# EAGLE design schematic (EAGLE 8.6.0)
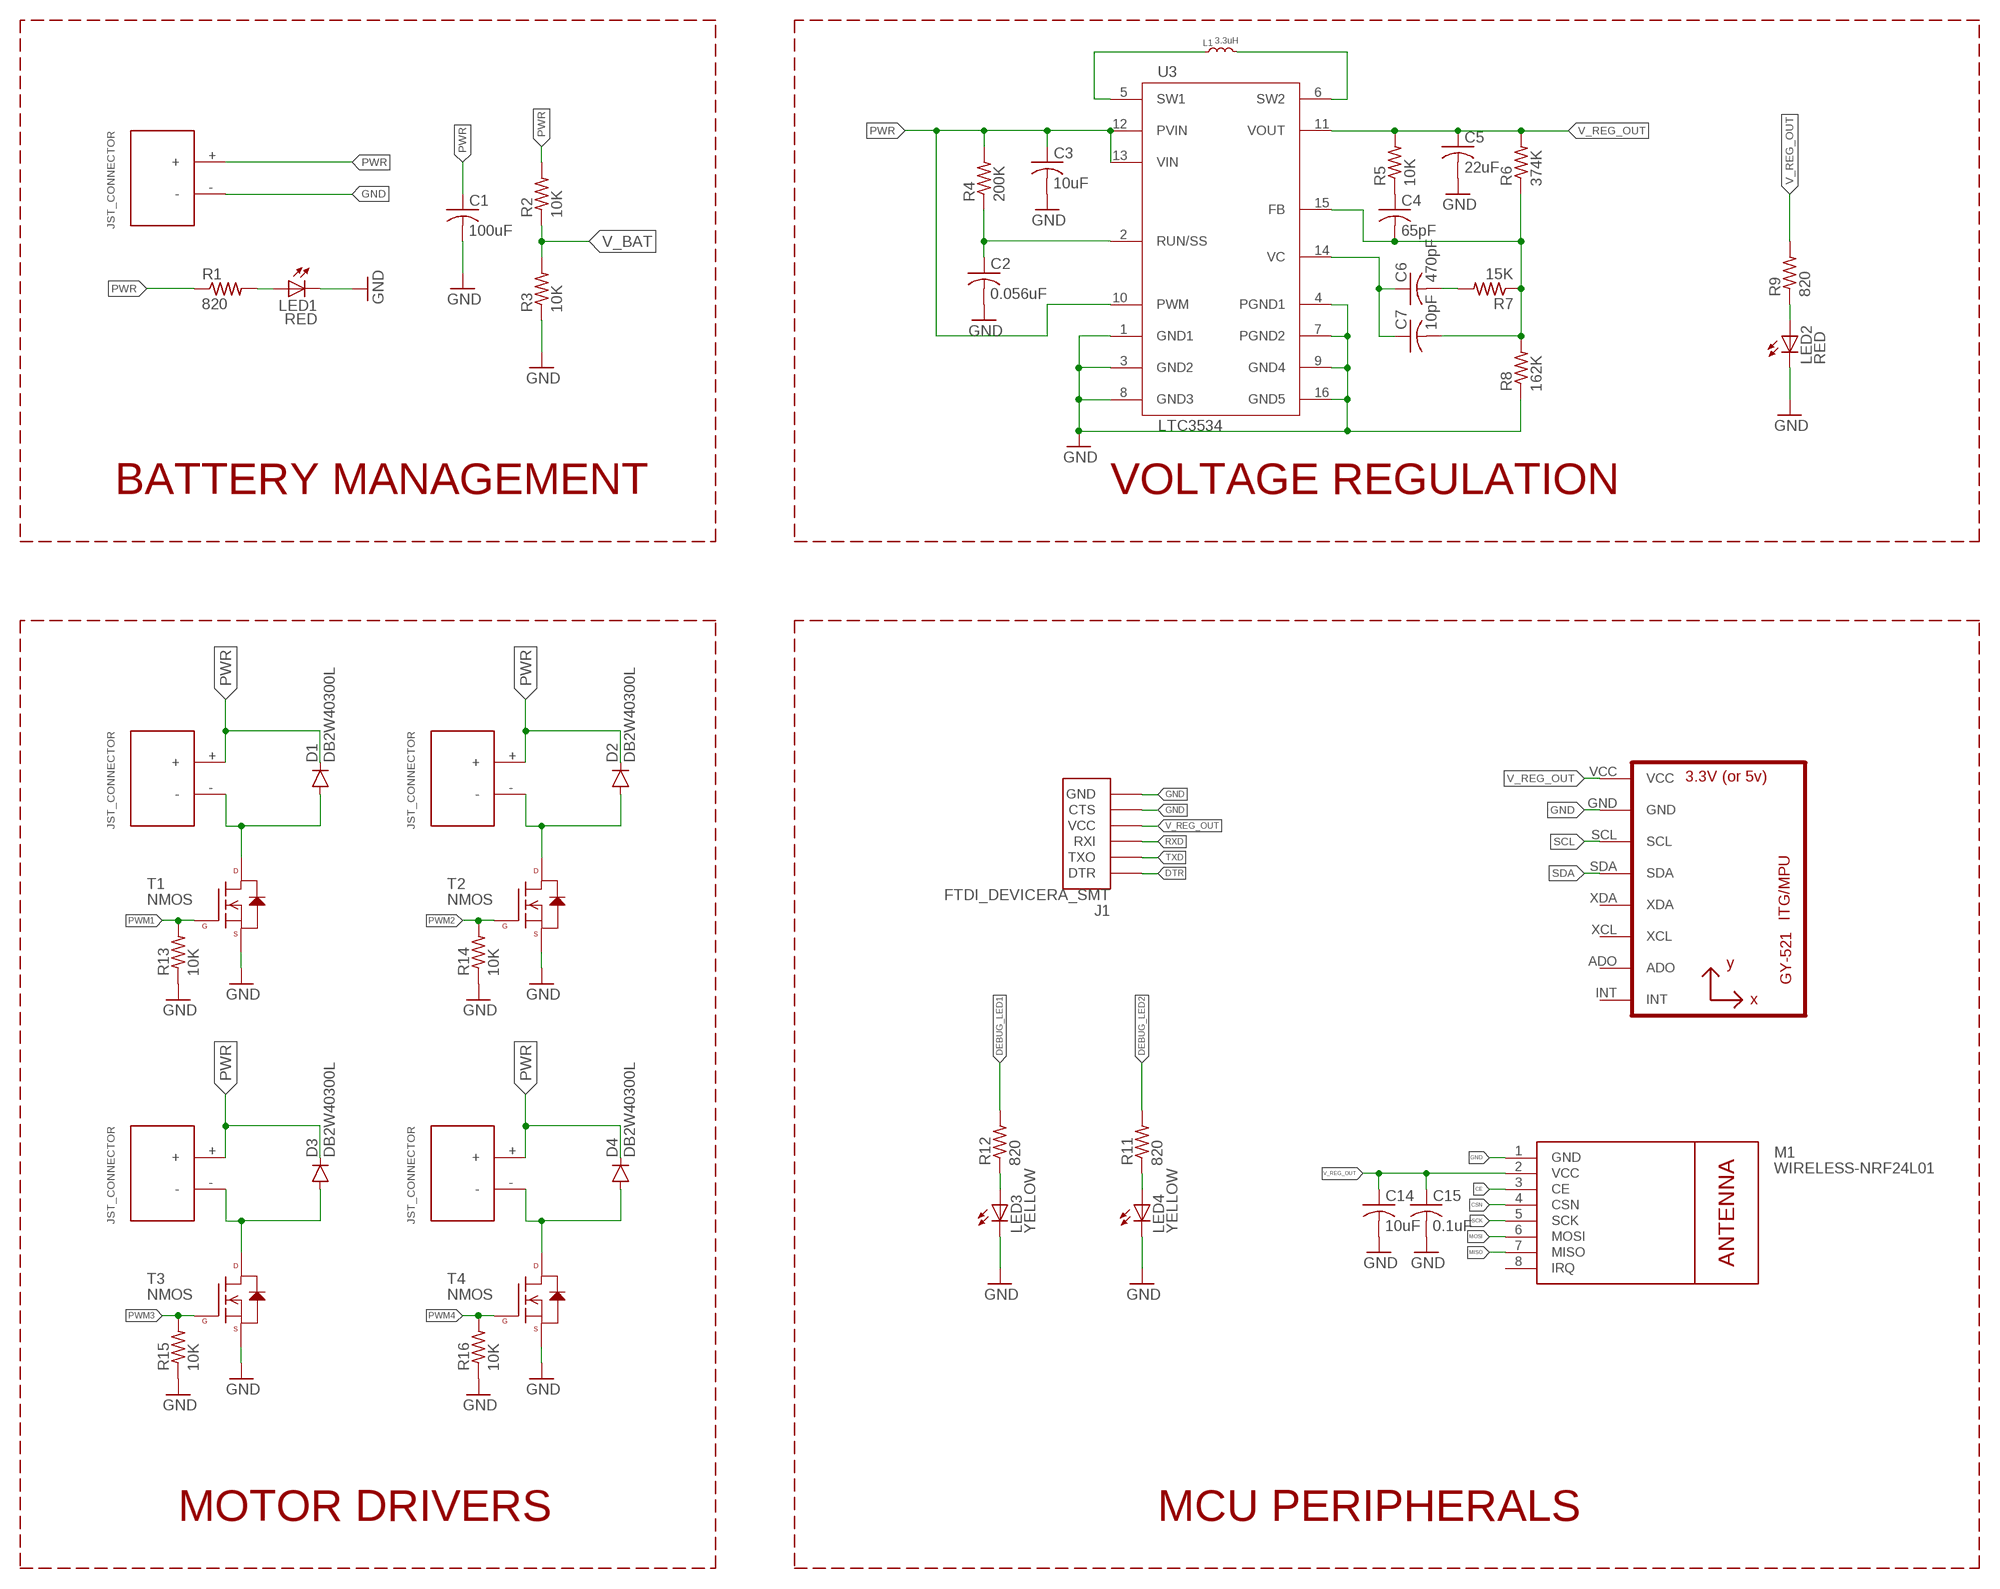
[diagram p0: schematic, sheet 1, part 1 of 2]
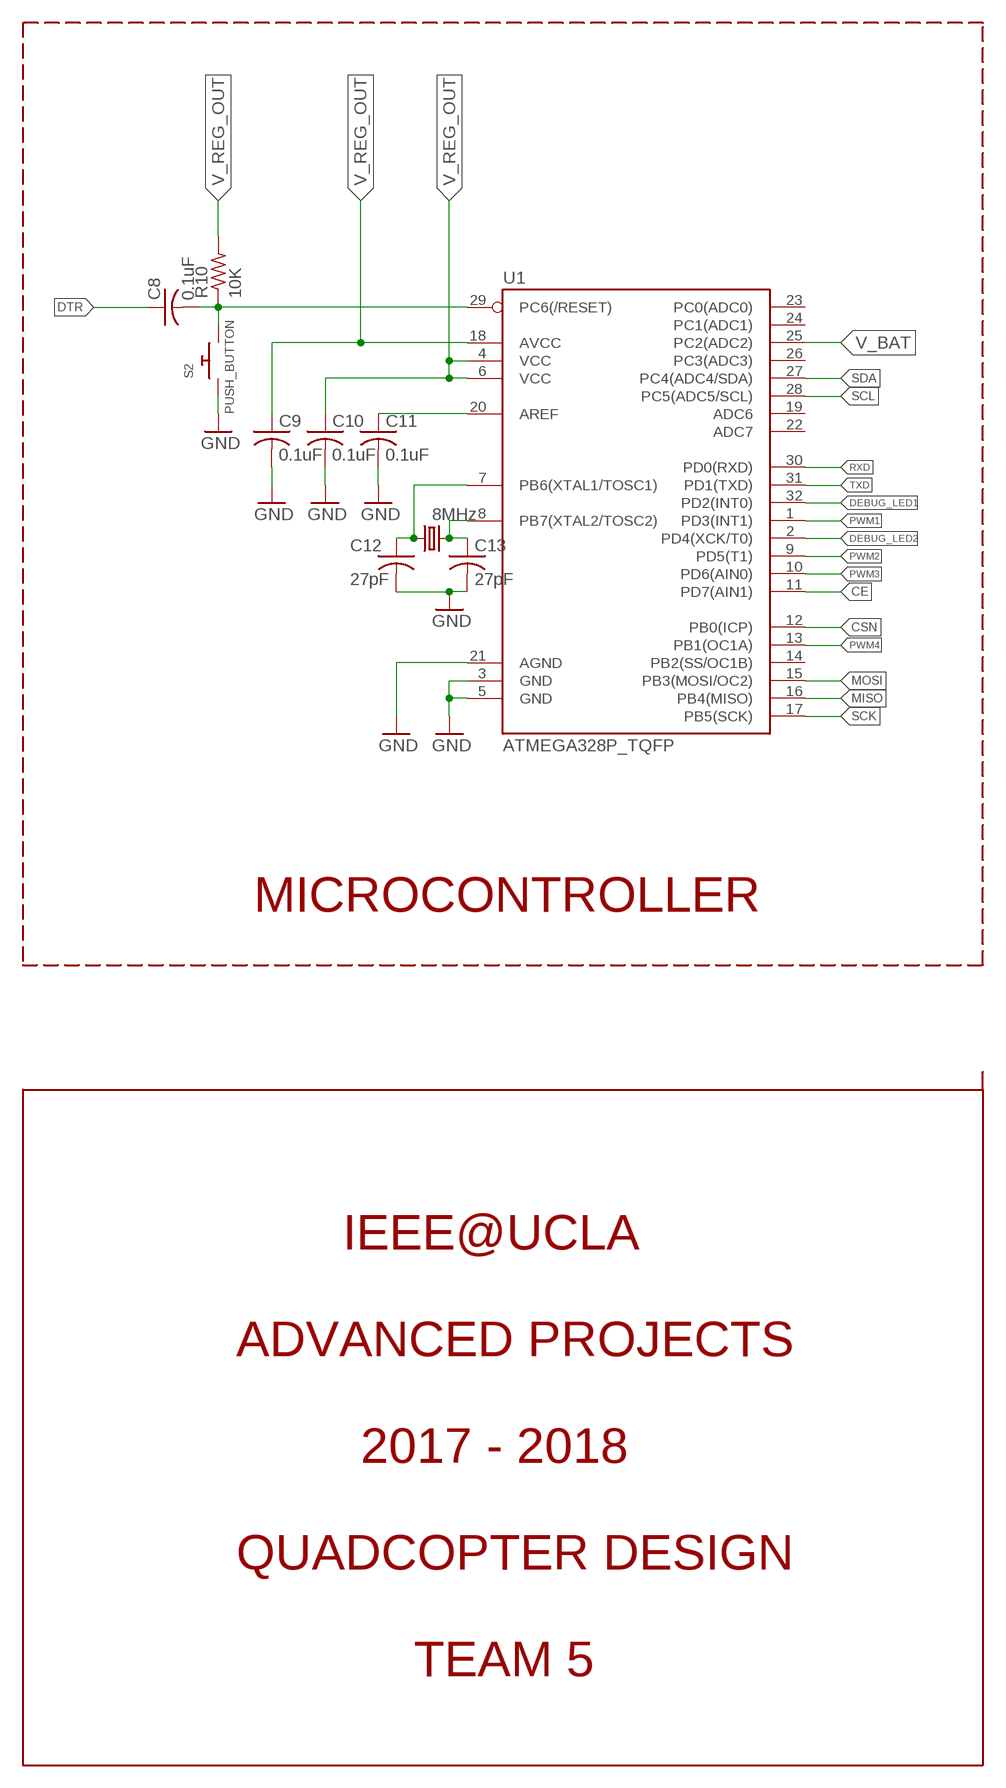
[diagram p1: schematic, sheet 1, part 2 of 2]

## Parts
C1  100uF  C-USC1210  [C1210]
C2  0.056uF  C-USC0603  [C0603]
C3  10uF  C-USC0603  [C0603]
C4  65pF  C-USC1206  [C1206]
C5  22uF  C-USC0603  [C0603]
C6  470pF  C-USC0603  [C0603]
C7  10pF  C-USC0603  [C0603]
C8  0.1uF  C-USC0603  [C0603]
C9  0.1uF  C-USC0603  [C0603]
C10  0.1uF  C-USC0603  [C0603]
C11  0.1uF  C-USC0603  [C0603]
C12  27pF  C-USC0603  [C0603]
C13  27pF  C-USC0603  [C0603]
C14  10uF  C-USC0603  [C0603]
C15  0.1uF  C-USC0603  [C0603]
D1  DB2W40300L  [MINI2-F3-B]
D2  DB2W40300L  [MINI2-F3-B]
D3  DB2W40300L  [MINI2-F3-B]
D4  DB2W40300L  [MINI2-F3-B]
J1  FTDI_DEVICERA_SMT  [FTDI_DEVICE_RA_SMT]
L1  3.3uH  INDUCTOR.XAL4020  [XAL4020]
LED1  RED  LEDSML0603  [SML0603]
LED2  RED  LEDSML0603  [SML0603]
LED3  YELLOW  LEDSML0603  [SML0603]
LED4  YELLOW  LEDSML0603  [SML0603]
M1  WIRELESS-NRF24L01  [WIRELESS-NRF24L01]
Q1  8MHz  CSM-7X-DU  [CSM-7X-DU]
R1  820  R-US_R0603  [R0603]
R2  10K  R-US_R0603  [R0603]
R3  10K  R-US_R0603  [R0603]
R4  200K  R-US_R0603  [R0603]
R5  10K  R-US_R0603  [R0603]
R6  374K  R-US_R0603  [R0603]
R7  15K  R-US_R0603  [R0603]
R8  162K  R-US_R0603  [R0603]
R9  820  R-US_R0603  [R0603]
R10  10K  R-US_R0603  [R0603]
R11  820  R-US_R0603  [R0603]
R12  820  R-US_R0603  [R0603]
R13  10K  R-US_R0603  [R0603]
R14  10K  R-US_R0603  [R0603]
R15  10K  R-US_R0603  [R0603]
R16  10K  R-US_R0603  [R0603]
S2  PUSH_BUTTON  SWITCH_PUSHBUTTONSOFTTOUCHSMD_SJ  [PUSHBUTTON_SMD_SJ]
T1  NMOS  N-CHANNEL-MOSFET-IRLML6244TRPBF  [SOT23-3]
T2  NMOS  N-CHANNEL-MOSFET-IRLML6244TRPBF  [SOT23-3]
T3  NMOS  N-CHANNEL-MOSFET-IRLML6244TRPBF  [SOT23-3]
T4  NMOS  N-CHANNEL-MOSFET-IRLML6244TRPBF  [SOT23-3]
U1  ATMEGA328P_TQFP  [TQFP32-08]
U2  GY-521MPU6050  [GY-521]
U3  LTC3534  [SSOP-16GN]
U$1  JST_CONNECTOR_FEMALE  [JST_CONNECTOR_FEMALE]
U$4  JST_CONNECTOR_FEMALE  [JST_CONNECTOR_FEMALE]
U$7  JST_CONNECTOR_FEMALE  [JST_CONNECTOR_FEMALE]
U$10  JST_CONNECTOR_FEMALE  [JST_CONNECTOR_FEMALE]
U$13  JST_CONNECTOR_FEMALE  [JST_CONNECTOR_FEMALE]

## Nets
CE: M1.3(CE) U1.11(PD7(AIN1))
CSN: M1.4(CSN) U1.12(PB0(ICP))
DEBUG_LED1: R12.2 U1.32(PD2(INT0))
DEBUG_LED2: R11.2 U1.2(PD4(XCK/T0))
DTR: C8.1 J1.1(DTR)
GND: C1.2 C2.2 C3.2 C5.2 C9.2 C10.2 C11.2 C12.2 C13.2 C14.2 C15.2 J1.5(CTS) J1.6(GND) LED1.C LED2.C LED3.C LED4.C M1.1(GND) R3.1 R8.1 R13.1 R14.1 R15.1 R16.1 S2.P$1 T1.2(S) T2.2(S) T3.2(S) T4.2(S) U1.3(GND) U1.5(GND) U1.21(AGND) U2.GND U3.1(GND1) U3.3(GND2) U3.4(PGND1) U3.7(PGND2) U3.8(GND3) U3.9(GND4) U3.16(GND5) U$1.-
MISO: M1.7(MISO) U1.16(PB4(MISO))
MOSI: M1.6(MOSI) U1.15(PB3(MOSI/OC2))
N$1: C12.1 Q1.1 U1.7(PB6(XTAL1/TOSC1))
N$2: C8.2 R10.1 S2.P$2 U1.29(PC6(/RESET))
N$3: D1.POS(PPIN) T1.3(D) U$4.-
N$4: C13.1 Q1.2 U1.8(PB7(XTAL2/TOSC2))
N$5: D2.POS(PPIN) T2.3(D) U$7.-
N$6: D3.POS(PPIN) T3.3(D) U$10.-
N$7: D4.POS(PPIN) T4.3(D) U$13.-
N$8: L1.1 U3.5(SW1)
N$9: L1.2 U3.6(SW2)
N$10: LED1.A R1.2
N$11: LED2.A R9.1
N$12: LED3.A R12.1
N$13: LED4.A R11.1
N$14: C4.1 R5.1
N$16: C2.1 R4.1 U3.2(RUN/SS)
N$18: C4.2 C7.2 R6.1 R7.1 R8.2 U3.15(FB)
N$19: C6.1 C7.1 U3.14(VC)
N$20: C6.2 R7.2
N$25: C11.1 U1.20(AREF)
PWM1: R13.2 T1.1(G) U1.1(PD3(INT1))
PWM2: R14.2 T2.1(G) U1.9(PD5(T1))
PWM3: R15.2 T3.1(G) U1.10(PD6(AIN0))
PWM4: R16.2 T4.1(G) U1.13(PB1(OC1A))
PWR: C1.1 C3.1 D1.NEG(GPIN) D2.NEG(GPIN) D3.NEG(GPIN) D4.NEG(GPIN) R1.1 R2.2 R4.2 U3.10(PWM) U3.12(PVIN) U3.13(VIN) U$1.+ U$4.+ U$7.+ U$10.+ U$13.+
RXD: J1.3(RXI) U1.30(PD0(RXD))
SCK: M1.5(SCK) U1.17(PB5(SCK))
SCL: U1.28(PC5(ADC5/SCL)) U2.SCL
SDA: U1.27(PC4(ADC4/SDA)) U2.SDA
TXD: J1.2(TXO) U1.31(PD1(TXD))
V_BAT: R2.1 R3.2 U1.25(PC2(ADC2))
V_REG_OUT: C5.1 C9.1 C10.1 C14.1 C15.1 J1.4(VCC) M1.2(VCC) R5.2 R6.2 R9.2 R10.2 U1.4(VCC) U1.6(VCC) U1.18(AVCC) U2.VCC U3.11(VOUT)
Unconnected: M1.8(IRQ) U1.14(PB2(SS/OC1B)) U1.19(ADC6) U1.22(ADC7) U1.23(PC0(ADC0)) U1.24(PC1(ADC1)) U1.26(PC3(ADC3)) U2.ADO U2.INT U2.XCL U2.XDA

## Notes on the sheet
- BATTERY MANAGEMENT | VOLTAGE REGULATION
- MICROCONTROLLER
- IEEE@UCLA
- ADVANCED PROJECTS
- 2017 - 2018
- QUADCOPTER DESIGN
- TEAM 5
- MOTOR DRIVERS | MCU PERIPHERALS

## Library data of the parts
C1 C4 C8-C11 = rcl:C-US: CAPACITOR, American symbol; SPICEPREFIX: C
C2 C3 C5-C7 C12-C15 = resistor:C-US: CAPACITOR, American symbol
D1-D4 = quad:DB2W40300L
J1 = quad:FTDI_DEVICE: Connector which mates to FTDI basic or FTDI cable.; PROD_ID: CONN-08971
L1 = coilcraft:INDUCTOR
LED1-LED4 = led:LED: LED OSRAM: - CHIPLED LG R971, LG N971, LY N971, LG Q971, LY Q971, LO R971, LY R971 LH N974, LH R974 LS Q976, LO Q976, LY Q976 LO Q996 - Hyper CHIPLED LW Q18S LB Q993, LB Q99A, LB R99A - SideLED LS A670, LO A670, LY A670, LG A670, LP A670 LB A673, LV A673, LT A673, LW A673 LH A674 LY A675 LS A676, LA A676, LO A676, LY A676, LW A676 LS A679, LY A679, LG A679 - Hyper Micro SIDELED® LS Y876, LA Y876, LO Y876, LY Y876 LT Y87S - SmartLED LW L88C, LW L88S LB L89C, LB L89S, LG L890 LS L89K, LO L89K, LY L89K LS L896, LA L896, LO L896, LY L896 - TOPLED LS T670, LO T670, LY T670, LG T670, LP T670 LSG T670, LSP T670, LSY T670, LOP T670, LYG T670 LG T671, LOG T671, LSG T671 LB T673, LV T673, LT T673, LW T673 LH T674 LS T676, LA T676, LO T676, LY T676, LB T676, LH T676, LSB T676, LW T676 LB T67C, LV T67C, LT T67C, LS T67K, LO T67K, LY T67K, LW E67C LS E67B, LA E67B, LO E67B, LY E67B, LB E67C, LV E67C, LT E67C LW T67C LS T679, LY T679, LG T679 LS T770, LO T770, LY T770, LG T770, LP T770 LB T773, LV T773, LT T773, LW T773 LH T774 LS E675, LA E675, LY E675, LS T675 LS T776, LA T776, LO T776, LY T776, LB T776 LHGB T686 LT T68C, LB T68C - Hyper Mini TOPLED® LB M676 - Mini TOPLED Santana® LG M470 LS M47K, LO M47K, LY M47K Source: http://www.osram.convergy.de LUXEON: - LUMILED® LXK2-PW12-R00, LXK2-PW12-S00, LXK2-PW14-U00, LXK2-PW14-V00 LXK2-PM12-R00, LXK2-PM12-S00, LXK2-PM14-U00 LXK2-PE12-Q00, LXK2-PE12-R00, LXK2-PE12-S00, LXK2-PE14-T00, LXK2-PE14-U00 LXK2-PB12-K00, LXK2-PB12-L00, LXK2-PB12-M00, LXK2-PB14-N00, LXK2-PB14-P00, LXK2-PB14-Q00 LXK2-PR12-L00, LXK2-PR12-M00, LXK2-PR14-Q00, LXK2-PR14-R00 LXK2-PD12-Q00, LXK2-PD12-R00, LXK2-PD12-S00 LXK2-PH12-R00, LXK2-PH12-S00 LXK2-PL12-P00, LXK2-PL12-Q00, LXK2-PL12-R00 Source: www.luxeon.com KINGBRIGHT: KA-3528ASYC Source: www.kingbright.com
M1 = quad:WIRELESS-NRF24L01: 2.4 GHz Wireless Module based on NRF24L01 chip
Q1 = crystal:CSM-7X-DU: SMD CRYSTAL Source: www.ecsxtal.com .. Crystal 3.6864MHz CSM_7X_DU.PDF; OC_FARNELL: unknown; OC_NEWARK: unknown
R1 R9 R11 R12 = rcl:R-US_: RESISTOR, American symbol; SPICEPREFIX: R
R2-R8 R10 R13-R16 = resistor:R-US_: RESISTOR, American symbol
S2 = adafruit:SWITCH_PUSHBUTTON: Buttons SOFTTOUCHSMD_SJ - Soft touch temporary push button (Super Junk Akihabara) Compatible with SKPMANE010 [Mouser: 688-SKPMAN] C&K_KSS = Digikey: KSS221GLFS
T1-T4 = quad:N-CHANNEL-MOSFET: N-Channel MOSFET Mode Field Effect Transistor; DATASHEET: http://www.mouser.com/ds/2/196/irlml6244pbf-936666.pdf; MOUSER: 942-IRLML6244TRPBF; URL: http://www.mouser.com/Search/ProductDetail.aspx?R=IRLML6244TRPBFvirtualkey57370000virtualkey942-IRLML6244TRPBF
U1 = quad:ATMEGA328P_TQFP; PROD_ID: IC-09069
U2 = quad:GY-521
U3 = LTC3534:LTC3534
U$1 U$4 U$7 U$10 U$13 = quad:JST_CONNECTOR_FEMALE

## Board
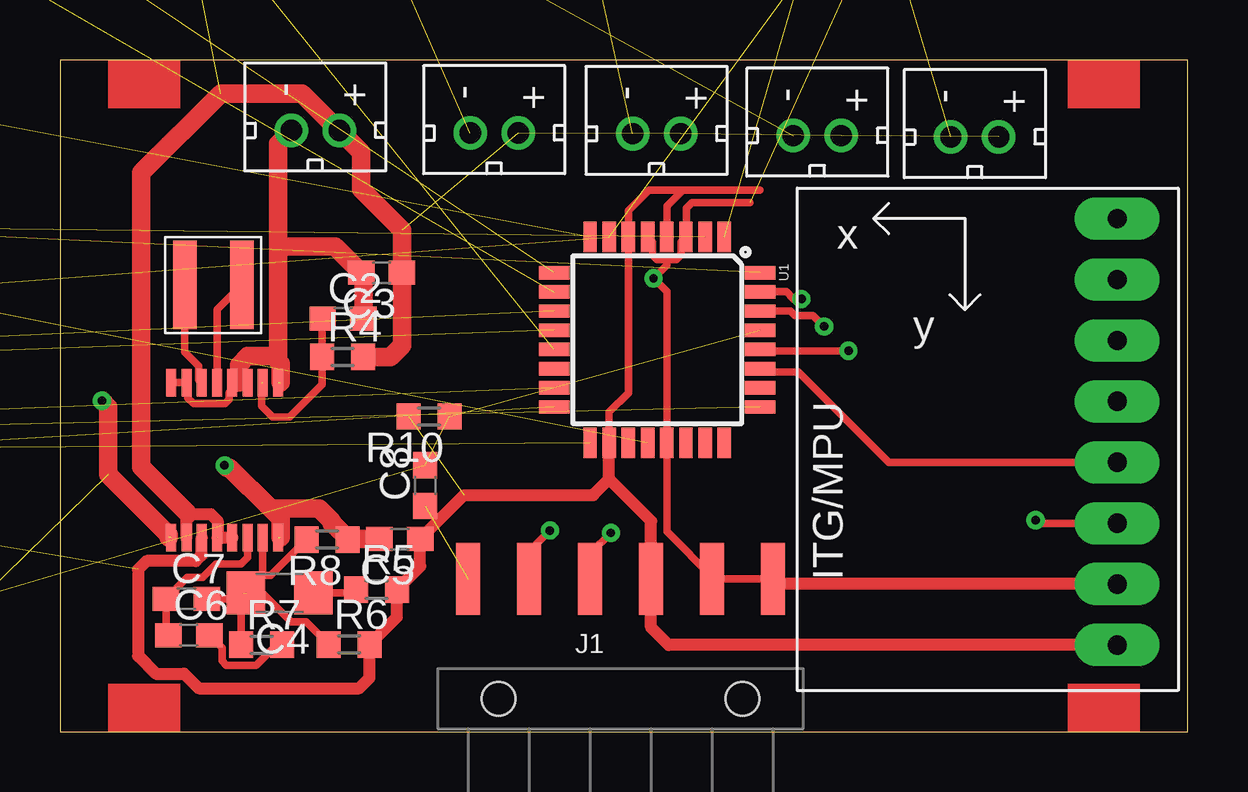
[diagram p2: board, top side]
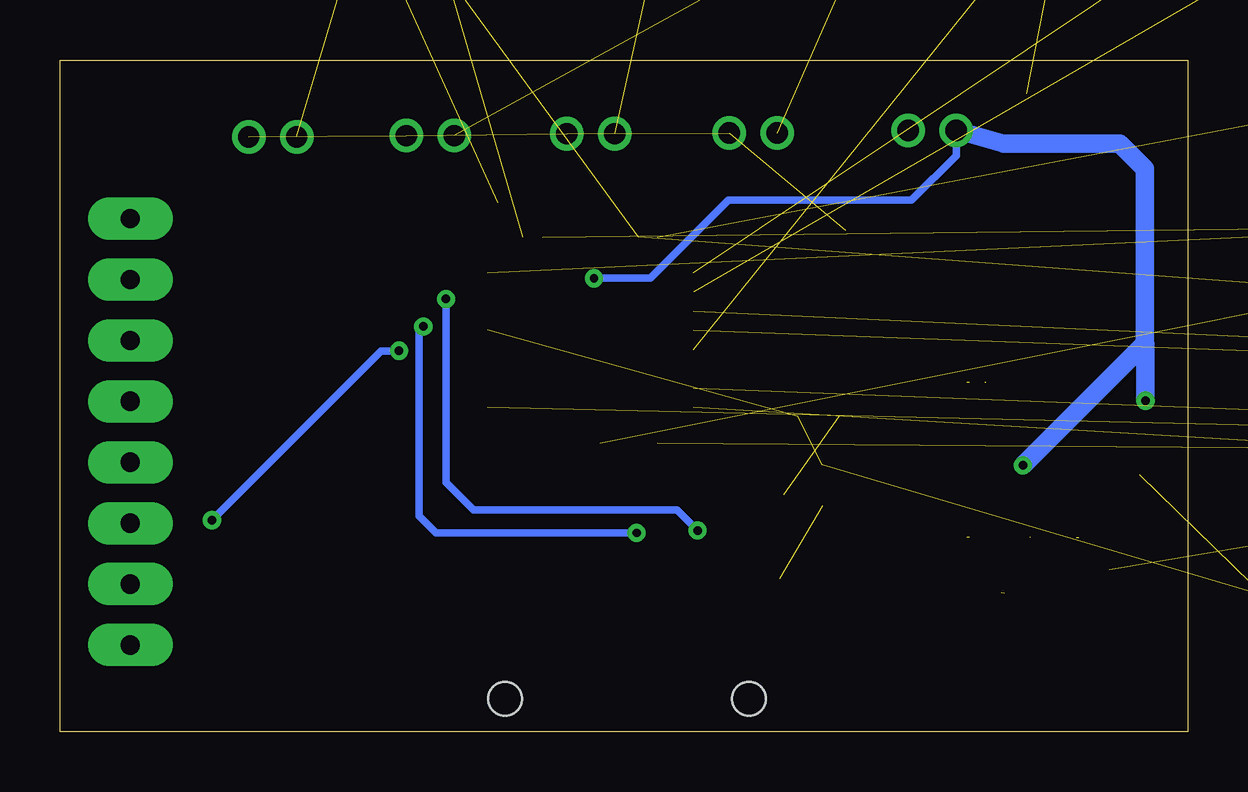
[diagram p3: board, bottom side, seen from below]

Size 47 x 28 mm. Coordinates in mm from the lower left corner, seen from the top.
Outline: 0,0 47,0 47,28 0,28 0,0
Copper layers (1*16): Top 0.035mm / dielectric 1.5mm / Bottom 0.035mm
Design rules "default": minimum track width 6mil, minimum drill 0.35mm, track to track 6mil, track to pad 6mil, pad to pad 6mil, via to via 6mil, smd to smd 6mil, copper to edge 40mil, drill to drill 6mil, minimum pad ring 10mil, minimum via ring 8mil, stop-mask expansion 4mil, vias tented up to drill 0mil, thermal gap 10mil

### Footprints (pad centres in the part's own frame; a part is rotated, then mirrored left to right if it is on the bottom)
C1210 = smd 1.6 x 2.7: 1 -1.4,0; 2 1.4,0
C0603 = smd 1.1 x 1: 1 -0.85,0; 2 0.85,0
C1206 = smd 1.6 x 1.8: 1 -1.4,0; 2 1.4,0
MINI2-F3-B = smd 1.22 x 0.85: NEG 0,1.55; POS 0,-1.5
FTDI_DEVICE_RA_SMT = smd 1 x 3: 1 -6.35,5; 2 -3.81,5; 3 -1.27,5; 4 1.27,5; 5 3.81,5; 6 6.35,5 | hole 1.4: -5.08,0; 5.08,0
XAL4020 = smd 0.98 x 3.7: 1 -1.185,0; 2 1.185,0
SML0603 = smd 0.8 x 0.8: A 0.75,0; C -0.75,0
WIRELESS-NRF24L01 = drill 1 square: 1 -12.7,6.35 | drill 1: 2 -10.16,6.35; 3 -12.7,3.81; 4 -10.16,3.81; 5 -12.7,1.27; 6 -10.16,1.27; 7 -12.7,-1.27; 8 -10.16,-1.27
CSM-7X-DU = smd 5.5 x 2: 1 -4.75,0; 2 4.75,0
R0603 = smd 1 x 1.1: 1 -0.85,0; 2 0.85,0
PUSHBUTTON_SMD_SJ = smd 2 x 2: P$1 3,0; P$2 -3,0
SOT23-3 = smd 0.8 x 0.9: 1 -0.95,-1; 2 0.95,-1; 3 0,1.1
TQFP32-08 = smd 1.27 x 0.559: 1 -4.293,2.8; 2 -4.293,2; 3 -4.293,1.2; 4 -4.293,0.4; 5 -4.293,-0.4; 6 -4.293,-1.2; 7 -4.293,-2; 8 -4.293,-2.8; 17 4.293,-2.8; 18 4.293,-2; 19 4.293,-1.2; 20 4.293,-0.4; 21 4.293,0.4; 22 4.293,1.2; 23 4.293,2; 24 4.293,2.8 | smd 0.559 x 1.27: 9 -2.8,-4.293; 10 -2,-4.293; 11 -1.2,-4.293; 12 -0.4,-4.293; 13 0.4,-4.293; 14 1.2,-4.293; 15 2,-4.293; 16 2.8,-4.293; 25 2.8,4.293; 26 2,4.293; 27 1.2,4.293; 28 0.4,4.293; 29 -0.4,4.293; 30 -1.2,4.293; 31 -2,4.293; 32 -2.8,4.293
GY-521 = drill 0.8 pad 1.778 long: ADO -8.89,-6.35; GND -8.89,6.35; INT -8.89,-8.89; SCL -8.89,3.81; SDA -8.89,1.27; VCC -8.89,8.89; XCL -8.89,-3.81; XDA -8.89,-1.27
SSOP-16GN = smd 0.419 x 1.143: 1 -2.223,-3.226; 2 -1.587,-3.226; 3 -0.953,-3.226; 4 -0.318,-3.226; 5 0.318,-3.226; 6 0.953,-3.226; 7 1.587,-3.226; 8 2.223,-3.226; 9 2.223,3.226; 10 1.587,3.226; 11 0.953,3.226; 12 0.318,3.226; 13 -0.318,3.226; 14 -0.953,3.226; 15 -1.587,3.226; 16 -2.223,3.226
JST_CONNECTOR_FEMALE = drill 0.889: + 0,1; - 0,-1

### Placement (x,y rotation side)
C1  -182.26,97.2 0 top  (outside the outline)
C2  11.8,17.22 0 top
C3  13.41,19.13 180 top
C4  9.16,5.78 180 top
C5  14.17,8.03 180 top
C6  5.37,4.02 0 top
C7  5.27,5.54 0 top
C8  15.23,10.25 90 top
C9  -182.07,63.31 0 top  (outside the outline)
C10  -182.07,58.43 0 top  (outside the outline)
C11  -182.07,53.56 0 top  (outside the outline)
C12  33.05,33.38 0 top  (outside the outline)
C13  -31.75,72.39 0 top  (outside the outline)
C14  -254.72,-18 0 top  (outside the outline)
C15  -254.72,-22.87 0 top  (outside the outline)
D1  -67.31,62.23 0 top  (outside the outline)
D2  -69.85,62.23 0 top  (outside the outline)
D3  10.44,86.79 0 top  (outside the outline)
D4  -2.16,70.38 0 top  (outside the outline)
J1  23.37,1.37 0 top
L1  6.39,18.62 180 top
LED1  -255.32,-47.86 0 top  (outside the outline)
LED2  -255.32,-51.7 0 top  (outside the outline)
LED3  -255.32,-55.55 0 top  (outside the outline)
LED4  -255.32,-59.39 0 top  (outside the outline)
M1  -44.45,10.16 0 top  (outside the outline)
Q1  -13.54,22.64 90 top  (outside the outline)
R1  -133.35,35.33 0 top  (outside the outline)
R2  -255.9,11.78 0 top  (outside the outline)
R3  -255.9,6.91 0 top  (outside the outline)
R4  11.78,15.62 0 top
R5  13.2,5.92 0 top
R6  12.05,3.63 0 top
R7  8.41,3.62 0 top
R8  11.14,8 180 top
R9  -133.35,31.03 0 top  (outside the outline)
R10  15.38,13.13 180 top
R11  -133.35,22.44 0 top  (outside the outline)
R12  -133.35,26.74 0 top  (outside the outline)
R13  -175.35,117.32 0 top  (outside the outline)
R14  -175.35,112.44 0 top  (outside the outline)
R15  -255.9,-27.75 0 top  (outside the outline)
R16  -255.9,-32.63 0 top  (outside the outline)
S2  -8.8,3.11 0 top  (outside the outline)
T1  33.15,37.08 0 top  (outside the outline)
T2  -50.8,68.58 0 top  (outside the outline)
T3  -63.5,68.58 0 top  (outside the outline)
T4  -24.13,73.66 0 top  (outside the outline)
U1  24.89,16.33 270 top
U2  35.18,12.5 180 top
U3  6.86,11.32 180 top
U$1  10.64,25.07 270 top
U$4  38.13,24.79 270 top
U$7  31.57,24.85 270 top
U$10  24.87,24.93 270 top
U$13  18.1,24.96 270 top

### Tracks (layer width: path | path; a pad name or v marks a point on that pad's centre or on a via)
CE  (1 unrouted)
CSN  (1 unrouted)
DEBUG_LED1  (1 unrouted)
DEBUG_LED2  (1 unrouted)
DTR  (1 unrouted)
GND  (via drill 0.35)  (26 unrouted)
  Top 0.305: U3.4 7.47,14.54 | 7.47,14.54 U3.3 | 7.47,14.54 7.06,14.13 7.06,13.85 6.88,13.67 5.57,13.67 5.33,13.91 5.33,14.49 U3.7 U3.8 | 25.3,19.68 24.89,19.68 24.71,19.86 24.71,20.41 U1.5 | 25.3,19.68 25.7,19.68 25.88,19.86 25.88,20.41 U1.3 26.11,20.64 26.11,21.82 26.34,22.05 28.75,22.05 | 25.3,19.68 25.3,19.46 v24.74,18.9 25.29,18.34 U1.21 25.29,8.33 27.25,6.37 | J1.6 29.39,6.37 27.25,6.37 | 27.25,6.37 J1.5
  Top 0.508: U2.GND 29.61,6.15 29.39,6.37
  Top 0.762: C2.2 12.65,19.03 C3.2 11.46,20.22 9.09,20.22 | 7.47,14.54 7.47,15.29 7.83,15.65 8.89,15.65 9.09,15.45 | 9.09,15.45 9.09,20.22 | 9.09,15.45 9.09,15.44 9.19,15.34 9.19,14.54 | 4.53,8.09 4.53,8.2 2.01,10.72 2.01,13.54 v1.75,13.79 | v6.86,11.1 6.96,11 7.08,11 8.79,9.29 | 9.09,20.22 9.09,24.51 U$1.- | C5.2 12.01,8.03 | 12.01,8.03 R8.1 | 8.79,9.29 9.19,8.88 9.19,8.09 | 11.32,8.67 11.32,8.72 | 8.79,9.29 10.8,9.29 11.32,8.77 11.32,8.72 | 11.32,8.72 12.01,8.03
  Bottom 0.305: v24.74,18.9 22.38,18.9 19.13,22.15 11.51,22.15 9.64,24.01 U$1.-
  Bottom 0.762: v6.86,11.1 1.78,16.18 | 1.78,16.18 1.78,23.47 2.82,24.51 7.66,24.51 U$1.- | v1.75,13.79 1.75,16.15 1.78,16.18
MISO  (1 unrouted)
MOSI  (1 unrouted)
N$1  (2 unrouted)
N$2  (3 unrouted)
N$3  (2 unrouted)
N$4  (2 unrouted)
N$5  (2 unrouted)
N$6  (2 unrouted)
N$7  (2 unrouted)
N$8
  Top 0.305: U3.5 6.54,17.59 L1.1
N$9
  Top 0.305: U3.6 5.79,14.66 5.79,15.24 5.2,15.83 L1.2
N$10  (1 unrouted)
N$11  (1 unrouted)
N$12  (1 unrouted)
N$13  (1 unrouted)
N$14
  Top 0.305: C4.1 12.21,5.78 R5.1
N$16  (1 unrouted)
  Top 0.305: C2.1 10.93,17.2 R4.1 10.93,14.46 9.58,13.11 8.87,13.11 8.4,13.57 8.4,14.54
N$18  (1 unrouted)
  Top 0.305: 7.22,5.72 C4.2 | C4.2 8.45,6.47 8.45,6.5 | 7.38,3.81 R7.1 7.56,5.4 7.42,5.54 | C7.2 7.42,5.54 | 7.42,5.54 7.64,5.76 | U3.15 8.45,6.5 | R6.1 10.26,4.57 9.63,4.57 8.43,5.78 C4.2 | R8.2 8.79,6.5 8.45,6.5
N$19
  Top 0.305: C6.1 4.42,4.12 C7.1 5.31,6.43 5.94,6.43 6.5,6.98 7.54,6.98 7.82,7.25 U3.14
N$20
  Top 0.305: R7.2 9.04,3.62 8.19,2.76 6.93,2.76 6.75,2.94 6.75,3.48 C6.2
N$25  (1 unrouted)
PWM1  (2 unrouted)
PWM2  (2 unrouted)
PWM3  (2 unrouted)
PWM4  (2 unrouted)
PWR  (12 unrouted)
  Top 0.508: U3.13 6.57,8.09 6.57,8.79 6.29,9.07 5.34,9.07 5.28,9.01 U3.10
  Top 0.762: R4.2 13.79,15.62 14.26,16.09 C3.1 14.26,20.9 12.55,22.6 12.55,24.16 U$1.+ 11.62,25.07 10.08,26.6 6.69,26.6 3.38,23.29 3.38,11.03 5.34,9.07
RXD  (via drill 0.35)
  Top 0.305: J1.3 22.1,7.42 v22.96,8.28 | U1.30 30.45,17.53 30.63,17.35 31.39,17.35 v31.85,16.89
  Bottom 0.305: v22.96,8.28 31.32,8.28 32.03,8.99 32.03,16.71 v31.85,16.89
SCK  (1 unrouted)
SCL  (via drill 0.35)
  Top 0.305: U2.SCL 40.79,8.69 v40.66,8.81 | v32.87,15.88 29.24,15.88 U1.28
  Bottom 0.305: v40.66,8.81 33.6,15.88 v32.87,15.88
SDA
  Top 0.305: U1.27 29.33,14.99 30.79,14.99 34.54,11.23 U2.SDA
TXD  (via drill 0.35)
  Top 0.305: J1.2 19.56,7.52 v20.42,8.38 | v30.91,18.03 30.58,18.03 30.28,18.34 U1.31
  Bottom 0.305: v20.42,8.38 21.29,9.25 29.77,9.25 30.91,10.39 v30.91,18.03
V_BAT  (2 unrouted)
V_REG_OUT  (7 unrouted)
  Top 0.305: 25.96,22.58 29.18,22.58 | U1.4 25.29,21.91 25.96,22.58 | 25.96,22.58 24.56,22.58 23.69,21.71 U1.6 23.69,14.12 22.89,13.32 U1.18
  Top 0.508: 22.89,10.52 22.23,9.86 16.85,9.86 C5.1 15.02,6.89 R5.2 14.05,4.77 R6.2 12.9,2.23 12.47,1.8 5.77,1.8 5.17,2.41 3.99,2.41 3.25,3.15 3.25,6.76 3.61,7.11 5.67,7.11 5.91,7.36 U3.11 | 22.89,10.52 U1.18 | 22.89,10.52 24.64,8.78 24.64,6.63 J1.4 24.64,4.34 25.38,3.61 U2.VCC
(copper drawn outside any net)
  shapes: Top area x13